# Altium schematic sheet TP_IHM_MAIN.SchDoc
size A4
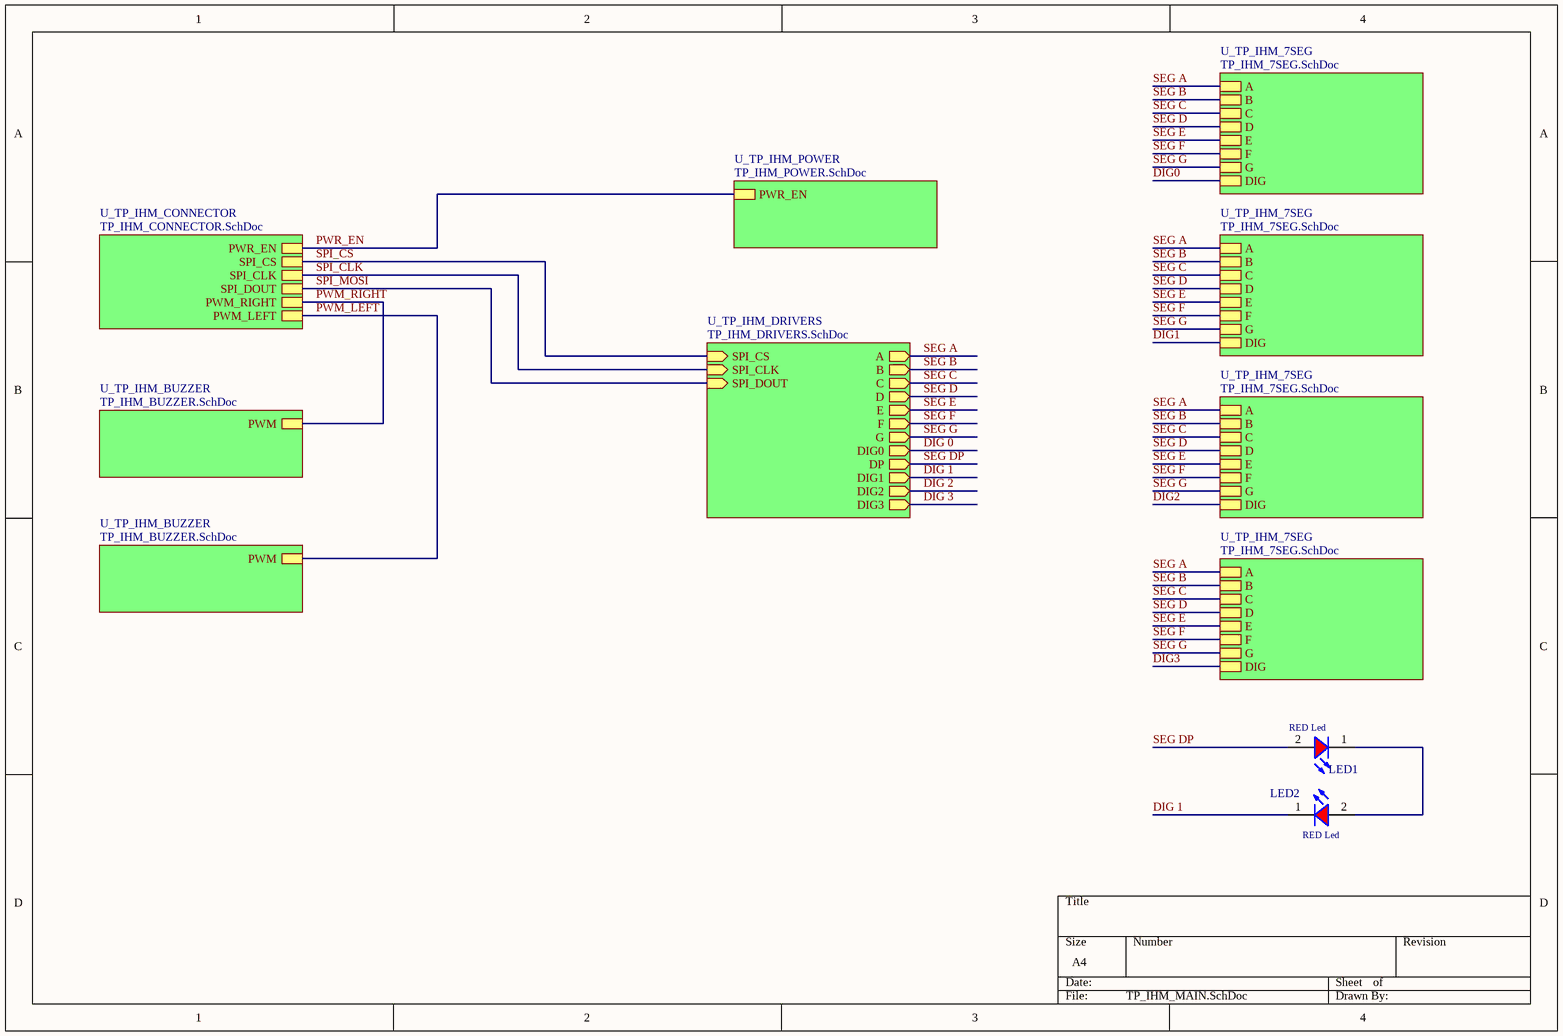
[diagram p0: TP_IHM_MAIN.SchDoc]

## Parts
LED1  RED Led  [LED_0603_RED]
LED2  RED Led  [LED_0603_RED]

## Sub-sheets
U_TP_IHM_7SEG = TP_IHM_7SEG.SchDoc: A, B, C, D, E, F, G, DIG
U_TP_IHM_7SEG = TP_IHM_7SEG.SchDoc: A, B, C, D, E, F, G, DIG
U_TP_IHM_7SEG = TP_IHM_7SEG.SchDoc: A, B, C, D, E, F, G, DIG
U_TP_IHM_7SEG = TP_IHM_7SEG.SchDoc: A, B, C, D, E, F, G, DIG
U_TP_IHM_BUZZER = TP_IHM_BUZZER.SchDoc: PWM
U_TP_IHM_BUZZER = TP_IHM_BUZZER.SchDoc: PWM
U_TP_IHM_CONNECTOR = TP_IHM_CONNECTOR.SchDoc: PWR_EN, SPI_CS, SPI_CLK, SPI_DOUT, PWM_RIGHT, PWM_LEFT
U_TP_IHM_DRIVERS = TP_IHM_DRIVERS.SchDoc: SPI_CS (in), SPI_CLK (in), A (out), B (out), C (out), D (out), E (out), F (out), G (out), DIG0 (out), SPI_DOUT (in), DP (out), DIG1 (out), DIG2 (out), DIG3 (out)
U_TP_IHM_POWER = TP_IHM_POWER.SchDoc: PWR_EN

## Nets
DIG0: sheet U_TP_IHM_7SEG/DIG
DIG1: sheet U_TP_IHM_7SEG/DIG
DIG2: sheet U_TP_IHM_7SEG/DIG
DIG3: sheet U_TP_IHM_7SEG/DIG
DIG 0: sheet U_TP_IHM_DRIVERS/DIG0
DIG 1: LED2.1(K) ; sheet U_TP_IHM_DRIVERS/DIG1
DIG 2: sheet U_TP_IHM_DRIVERS/DIG2
DIG 3: sheet U_TP_IHM_DRIVERS/DIG3
PWM_LEFT: sheet U_TP_IHM_CONNECTOR/PWM_LEFT, sheet U_TP_IHM_BUZZER/PWM
PWM_RIGHT: sheet U_TP_IHM_BUZZER/PWM, sheet U_TP_IHM_CONNECTOR/PWM_RIGHT
PWR_EN: sheet U_TP_IHM_CONNECTOR/PWR_EN, sheet U_TP_IHM_POWER/PWR_EN
SEG A: sheet U_TP_IHM_7SEG/A, sheet U_TP_IHM_DRIVERS/A, sheet U_TP_IHM_7SEG/A, sheet U_TP_IHM_7SEG/A, sheet U_TP_IHM_7SEG/A
SEG B: sheet U_TP_IHM_7SEG/B, sheet U_TP_IHM_DRIVERS/B, sheet U_TP_IHM_7SEG/B, sheet U_TP_IHM_7SEG/B, sheet U_TP_IHM_7SEG/B
SEG C: sheet U_TP_IHM_7SEG/C, sheet U_TP_IHM_DRIVERS/C, sheet U_TP_IHM_7SEG/C, sheet U_TP_IHM_7SEG/C, sheet U_TP_IHM_7SEG/C
SEG D: sheet U_TP_IHM_7SEG/D, sheet U_TP_IHM_DRIVERS/D, sheet U_TP_IHM_7SEG/D, sheet U_TP_IHM_7SEG/D, sheet U_TP_IHM_7SEG/D
SEG DP: LED1.2(A) ; sheet U_TP_IHM_DRIVERS/DP
SEG E: sheet U_TP_IHM_7SEG/E, sheet U_TP_IHM_DRIVERS/E, sheet U_TP_IHM_7SEG/E, sheet U_TP_IHM_7SEG/E, sheet U_TP_IHM_7SEG/E
SEG F: sheet U_TP_IHM_7SEG/F, sheet U_TP_IHM_DRIVERS/F, sheet U_TP_IHM_7SEG/F, sheet U_TP_IHM_7SEG/F, sheet U_TP_IHM_7SEG/F
SEG G: sheet U_TP_IHM_7SEG/G, sheet U_TP_IHM_DRIVERS/G, sheet U_TP_IHM_7SEG/G, sheet U_TP_IHM_7SEG/G, sheet U_TP_IHM_7SEG/G
SPI_CLK: sheet U_TP_IHM_CONNECTOR/SPI_CLK, sheet U_TP_IHM_DRIVERS/SPI_CLK
SPI_CS: sheet U_TP_IHM_CONNECTOR/SPI_CS, sheet U_TP_IHM_DRIVERS/SPI_CS
SPI_MOSI: sheet U_TP_IHM_CONNECTOR/SPI_DOUT, sheet U_TP_IHM_DRIVERS/SPI_DOUT
NetLED1_1: LED1.1(K) LED2.2(A)

## Library data of the parts
LED1 LED2 = LED_RED_SMD_WE_150060RS750x0: LED RED SMD WE 150060RS750x0; ref: 150060RS750x0